# Altium schematic sheet 5V0 +12V0 rails.SchDoc
size A
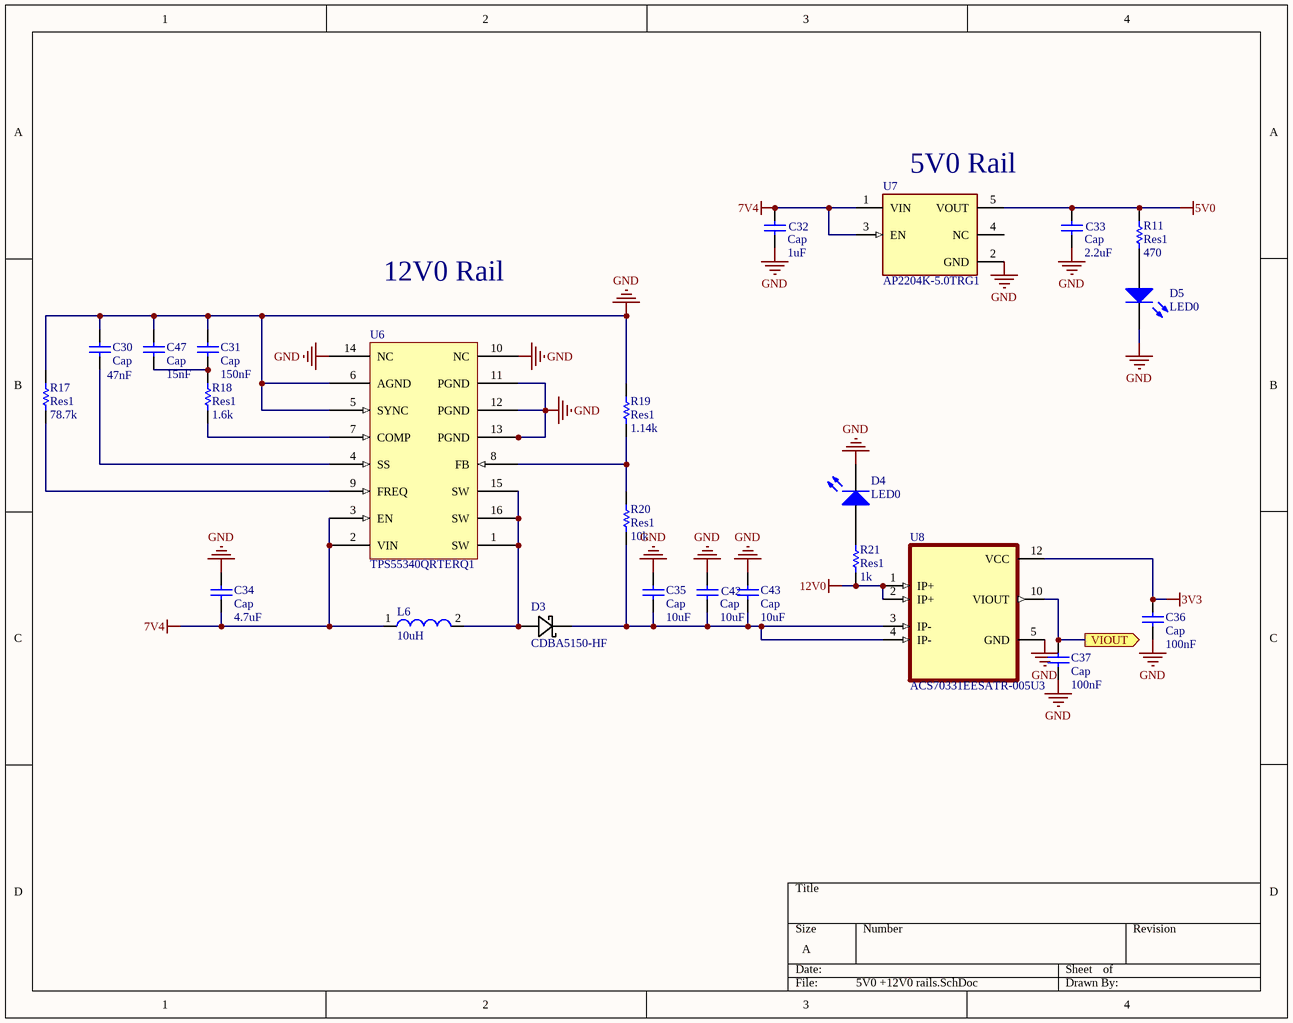
[diagram p0: 5V0 +12V0 rails.SchDoc]

## Parts
C30  Cap  value 47nF  [0402-A]
C31  Cap  value 150nF  [0402-A]
C32  Cap  value 1uF  [1608[0603]]
C33  Cap  value 2.2uF  [0402-A]
C34  Cap  value 4.7uF  [6-0805_M]
C35  Cap  value 10uF  [6-0805_M]
C36  Cap  value 100nF  [1608[0603]]
C37  Cap  value 100nF  [1608[0603]]
C42  Cap  value 10uF  [6-0805_M]
C43  Cap  value 10uF  [6-0805_M]
C47  Cap  value 15nF  [0402-A]
D3  CDBA5150-HF  [CDBA5]
D4  LED0  [1608[0603]]
D5  LED0  [1608[0603]]
L6  10uH  [WE-PD-L]
R11  Res1  value 470  [6-0805_M]
R17  Res1  value 78.7k  [0402-A]
R18  Res1  value 1.6k  [0402-A]
R19  Res1  value 1.14k  [6-0805_M]
R20  Res1  value 10k  [0402-A]
R21  Res1  value 1k  [0402-A]
U6  TPS55340QRTERQ1  [TPS55340QRTERQ1]
U7  AP2204K-5.0TRG1  [FP-SOT25-IPC_B]
U8  ACS70331EESATR-005U3  [ALLEGRO_ACS70331EESATR-005U3]

## Ports
VIOUT (out)

## Nets
3V3: C36.1 U8.12(VCC)
5V0: C33.2 R11.2 U7.5(VOUT)
7V4: C32.2 C34.1 L6.1 U6.2(VIN) U6.3(EN) U7.1(VIN) U7.3(EN)
12V0: R21.2 U8.1(IP+) U8.2(IP+)
GND: C30.2 C31.2 C32.1 C33.1 C34.2 C35.2 C36.2 C37.2 C42.2 C43.2 C47.2 D4.2(K) D5.2(K) R17.2 R19.2 U6.5(SYNC) U6.6(AGND) U6.10(NC) U6.11(PGND) U6.12(PGND) U6.13(PGND) U6.14(NC) U6.17 U7.2(GND) U8.5(GND)
VIOUT: C37.1 U8.10(VIOUT) ; port VIOUT
NetC30_1: C30.1 U6.4(SS)
NetC31_1: C31.1 C47.1 R18.2
NetC35_1: C35.1 C42.1 C43.1 D3.1 R20.1 U8.3(IP-) U8.4(IP-)
NetD3_2: D3.2 L6.2 U6.1(SW) U6.15(SW) U6.16(SW)
NetD4_1: D4.1(A) R21.1
NetD5_1: D5.1(A) R11.1
NetR17_1: R17.1 U6.9(FREQ)
NetR18_1: R18.1 U6.7(COMP)
NetR19_1: R19.1 R20.2 U6.8(FB)

Not connected (* = marked no-connect by the designer): U7 4(NC)

## Notes on the sheet
- (near U7) 5V0 Rail
- 12V0 Rail

## Library data of the parts
C30-C37 C42 C43 C47 = Cap: Capacitor; Published: 8-Jun-2000; LatestRevisionDate: 17-Jul-2002; LatestRevisionNote: Re-released for DXP Platform.; PackageReference: RAD-0.3; Publisher: Altium Limited; PackageDescription: Radial Cap, Thru-Hole; 2 Leads; 0.3 in Pin Spacing
D3 = CDBA5150-HF: No Description Available; Vendor: Comchip; Built_By: EMA_UL_Team; SourceLibrary: ComchipTechnology_2015-04-20; Type: DEV; Manufacturer_Part_Number: CDBA5150-HF; Copyright: Copyright (C) 2018 Accelerated Designs. All rights reserved; RefDes: RefDes
L6 = CMP-0227-00708-1: SMD-Shielded Power Inductor WE-PD, L = 10.0 µH; Inductance: 10.0 ÂµH; ComponentLink2Description: Datasheet; DatasheetVersion: ver 7, Sep-2006; PackageVersion: 2006; ComponentLink1URL: http://www.we-online.com; ComponentLink1Description: Manufacturer Link; ComponentLink2URL: http://www.we-online.de/katalog/media/pdf/74477110.pdf; PackageDescription: SMD Inductor, 2-Leads, Body 12.0 x 12.0 mm; PackageReference: WE-PD-L
R11 R17-R21 = Res1: Resistor; Published: 8-Jun-2000; LatestRevisionDate: 17-Jul-2002; LatestRevisionNote: Re-released for DXP Platform.; PackageReference: AXIAL-0.3; Publisher: Altium Limited; PackageDescription: Axial Device, Thru-Hole; 2 Leads; 0.3 in Pin Spacing
U7 = CMP-12756-000033-1: IC REG LINEAR 5V 150MA SOT23-5; Operating Supply Current: 50uA; Number of Outputs: 1; Output Type: Fixed; Power Supply Rejection Ratio (PSRR): 60dB; Max Output Current: 250mA; Dropout Voltage: 360mV; Reference Voltage: 1.265V; Polarity: Positive; Max Input Voltage: 24V; Min Input Voltage: 2.3V; Min Operating Temperature: -40°C; Max Operating Temperature: 85°C; Case/Package: SOT-23-5; Quiescent Current: 50uA; Width: 1.7mm; Number of Regulators: 1; Package Quantity: 3000; Length: 3.02mm; Lead Free: Lead Free; Number of Pins: 5; Weight: 0.001058oz; Packaging: Tape and Reel; Mount: Surface Mount; Output Voltage: 5V; Output Current: 150mA; Height: 1.3mm
U8 = ACS70331EESATR-005U3: Current Sensor 5A 1 Channel Hall Effect, Open Loop Unidirectional 12-PowerWQFN; MF: Allegro MicroSystems LLC; Value: *; Digi-Key_Purchase_URL: https://www.digikey.com/product-detail/en/allegro-microsystems/ACS70331EESATR-005U3/620-1888-1-ND/8120688?utm_source=snapeda&utm_medium=aggregator&utm_campaign=symbol; Digi-Key_Part_Number: 620-1888-1-ND; Package: WFQFN-12 Allegro MicroSystems LLC; SnapEDA_Link: https://www.snapeda.com/parts/ACS70331EESATR-005U3/Allegro%20MicroSystems%20LLC/view-part/2732756/?ref=snap; MP: ACS70331EESATR-005U3
D4 D5 = LED0: Published: 8-Jun-2000; LatestRevisionDate: 08-Jul-2005; LatestRevisionNote: Mech Layer 1 removed.; PackageReference: LED-0; Publisher: Altium Limited; PackageDescription: LED; 2 Leads